# Altium schematic sheet Main.SchDoc: Наименование
size 209 x 297 mm; ApprovedBy: Утвердил; CheckedBy: Проверил; Author: Разработал; CompanyName: Организация; DrawnBy: Н.Контр; Engineer: Т.Контр; SheetNumber: 1; SheetTotal: 6; PageSetup: Record=PageOptions|CenterHorizontal=True|CenterVertical=True|PrintScale=0.94|XCorrection=1.00|YCorrection=1.00|PrintKind=1|BorderSize=5000000|LeftOffset=0|BottomOffset=0|Orientation=1|PaperLength=1000|PaperWidth=1000|Scale=100|PaperSource=7|PrintQuality=-4|MediaType=1|DitherType=10|PaperKind=A4|PrintScaleMode=1; DecimalNumber: Децимальный номер; HeadOfSector: Нач. сектора; MainDevice: Перв.примен.; Name: Наименование; DocumentName: Sheet1.SCHDOC
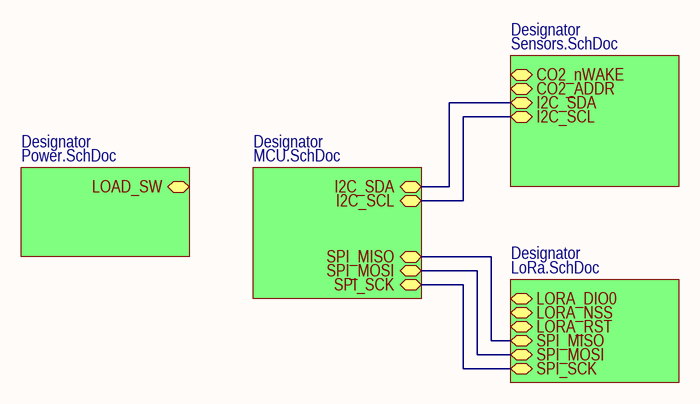
[diagram p0: Main.SchDoc]

## Sub-sheets
Designator = Power.SchDoc: LOAD_SW (bidir)
Designator = MCU.SchDoc: I2C_SDA (bidir), I2C_SCL (bidir), SPI_MISO (bidir), SPI_MOSI (bidir), SPI_SCK (bidir)
Designator = LoRa.SchDoc: LORA_DIO0 (bidir), LORA_NSS (bidir), LORA_RST (bidir), SPI_MISO (bidir), SPI_MOSI (bidir), SPI_SCK (bidir)
Designator = Sensors.SchDoc: CO2_ADDR (bidir), I2C_SDA (bidir), CO2_nWAKE (bidir), I2C_SCL (bidir)

## Nets
(unnamed): sheet Designator/I2C_SDA, sheet Designator/I2C_SDA
(unnamed): sheet Designator/I2C_SCL, sheet Designator/I2C_SCL
(unnamed): sheet Designator/SPI_MISO, sheet Designator/SPI_MISO
(unnamed): sheet Designator/SPI_MOSI, sheet Designator/SPI_MOSI
(unnamed): sheet Designator/SPI_SCK, sheet Designator/SPI_SCK

## Notes on the sheet
- Перв.примен.
- Справ.№
- Подп. и дата
- Инв.№ дубл.
- Взам.инв.№
- Подп.и дата
- Разраб.
- Изм.
- Лист
- № докум.
- Подп.
- Дата
- Лит.
- Масштаб
- Масса
- Т.контр.
- Пров.
- ПРИНЦИПИАЛЬНАЯ
- СХЕМА   ЭЛЕКТРИЧЕСКАЯ
- Листов
- Инв.№ подл.
- Утв.
- Н.контр.
- Нач.сект.
- Копировал
- Формат  A3